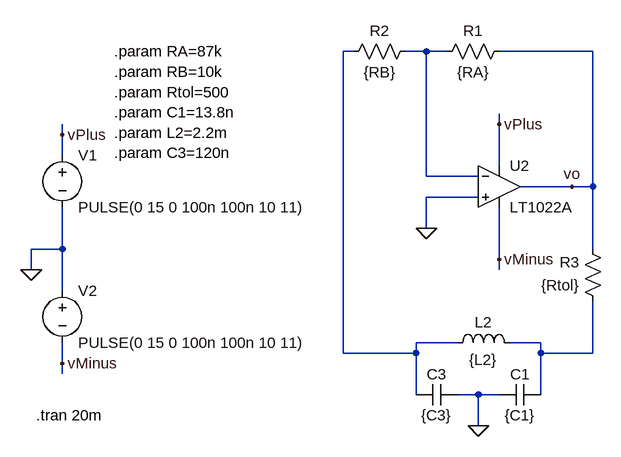
[diagram p0: schematic ColpittsReal.asc]
ColpittsReal.asc, the LTspice schematic file:
Version 4
SHEET 1 880 680
WIRE 128 -128 112 -128
WIRE 240 -128 208 -128
WIRE 272 -128 240 -128
WIRE 496 -128 352 -128
WIRE 352 -16 352 -32
WIRE -320 0 -320 -16
WIRE -320 32 -320 0
WIRE 352 48 352 -16
WIRE 240 64 240 -128
WIRE 320 64 240 64
WIRE 464 80 384 80
WIRE 496 80 496 -128
WIRE 496 80 464 80
WIRE 320 96 240 96
WIRE 240 144 240 96
WIRE -320 176 -320 112
WIRE -320 176 -368 176
WIRE 496 176 496 80
WIRE 352 192 352 112
WIRE -368 208 -368 176
WIRE 352 208 352 192
WIRE -320 240 -320 176
WIRE 288 320 224 320
WIRE 416 320 368 320
WIRE 112 336 112 -128
WIRE 224 336 224 320
WIRE 224 336 112 336
WIRE 416 336 416 320
WIRE 496 336 496 256
WIRE 496 336 416 336
WIRE -320 352 -320 320
WIRE -320 368 -320 352
WIRE 224 400 224 336
WIRE 320 400 288 400
WIRE 352 400 320 400
WIRE 416 400 416 336
WIRE 320 448 320 400
FLAG -368 208 0
FLAG -320 0 vPlus
FLAG -320 352 vMinus
FLAG 352 -16 vPlus
FLAG 352 192 vMinus
FLAG 464 80 vo
FLAG 320 448 0
FLAG 240 144 0
SYMBOL voltage -320 16 R0
WINDOW 123 0 0 Left 2
WINDOW 39 0 0 Left 2
SYMATTR InstName V1
SYMATTR Value PULSE(0 15 0 100n 100n 10 11)
SYMBOL voltage -320 224 R0
WINDOW 123 0 0 Left 2
WINDOW 39 0 0 Left 2
SYMATTR InstName V2
SYMATTR Value PULSE(0 15 0 100n 100n 10 11)
SYMBOL res 368 -144 R90
WINDOW 0 0 56 VBottom 2
WINDOW 3 32 56 VTop 2
SYMATTR InstName R1
SYMATTR Value {RA}
SYMBOL res 224 -144 R90
WINDOW 0 0 56 VBottom 2
WINDOW 3 32 56 VTop 2
SYMATTR InstName R2
SYMATTR Value {RB}
SYMBOL cap 416 384 R90
WINDOW 0 0 32 VBottom 2
WINDOW 3 32 32 VTop 2
SYMATTR InstName C1
SYMATTR Value {C1}
SYMBOL cap 224 416 R270
WINDOW 0 32 32 VTop 2
WINDOW 3 0 32 VBottom 2
SYMATTR InstName C3
SYMATTR Value {C3}
SYMBOL res 512 272 R180
WINDOW 0 36 76 Left 2
WINDOW 3 36 40 Left 2
SYMATTR InstName R3
SYMATTR Value {Rtol}
SYMBOL ind 272 336 R270
WINDOW 0 32 56 VTop 2
WINDOW 3 5 56 VBottom 2
SYMATTR InstName L2
SYMATTR Value {L2}
SYMBOL Opamps\\LT1022A 352 16 R0
SYMATTR InstName U2
TEXT -360 432 Left 2 !.tran 20m
TEXT -240 -128 Left 2 !.param RA=87k\n.param RB=10k\n.param Rtol=500\n.param C1=13.8n\n.param L2=2.2m\n.param C3=120n

The netlist it stands for:
* ColpittsReal.asc
V1 vPlus 0 PULSE(0 15 0 100n 100n 10 11)
V2 0 vMinus PULSE(0 15 0 100n 100n 10 11)
R1 vo N002 {RA}
R2 N002 N001 {RB}
C1 N003 0 {C1}
C3 N001 0 {C3}
R3 N003 vo {Rtol}
L2 N001 N003 {L2}
XU2 0 N002 vPlus vMinus vo LT1022A  ; pins In+ In- V+ V- OUT
.tran 20m
.param RA=87k
.param RB=10k
.param Rtol=500
.param C1=13.8n
.param L2=2.2m
.param C3=120n
.backanno
.end